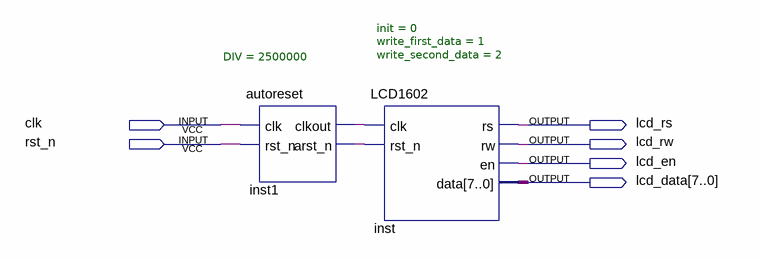
[diagram p0: schematic sheet]
// Quartus schematic LCD_test.bdf as structural Verilog: 2 symbols, 6 pins
module LCD_test (
  input  clk,
  input  rst_n,
  output lcd_rs,
  output lcd_rw,
  output lcd_en,
  output [7:0] lcd_data
);

  wire inst1_arst_n, inst1_clkout;

  autoreset #(.DIV(2500000)) inst1 (.clk(clk), .rst_n(rst_n), .clkout(inst1_clkout), .arst_n(inst1_arst_n));
  LCD1602 #(.init(0), .write_first_data(1), .write_second_data(2)) inst (
    .clk(inst1_clkout), .rst_n(inst1_arst_n), .rs(lcd_rs), .rw(lcd_rw), .en(lcd_en), .data(lcd_data));
endmodule
